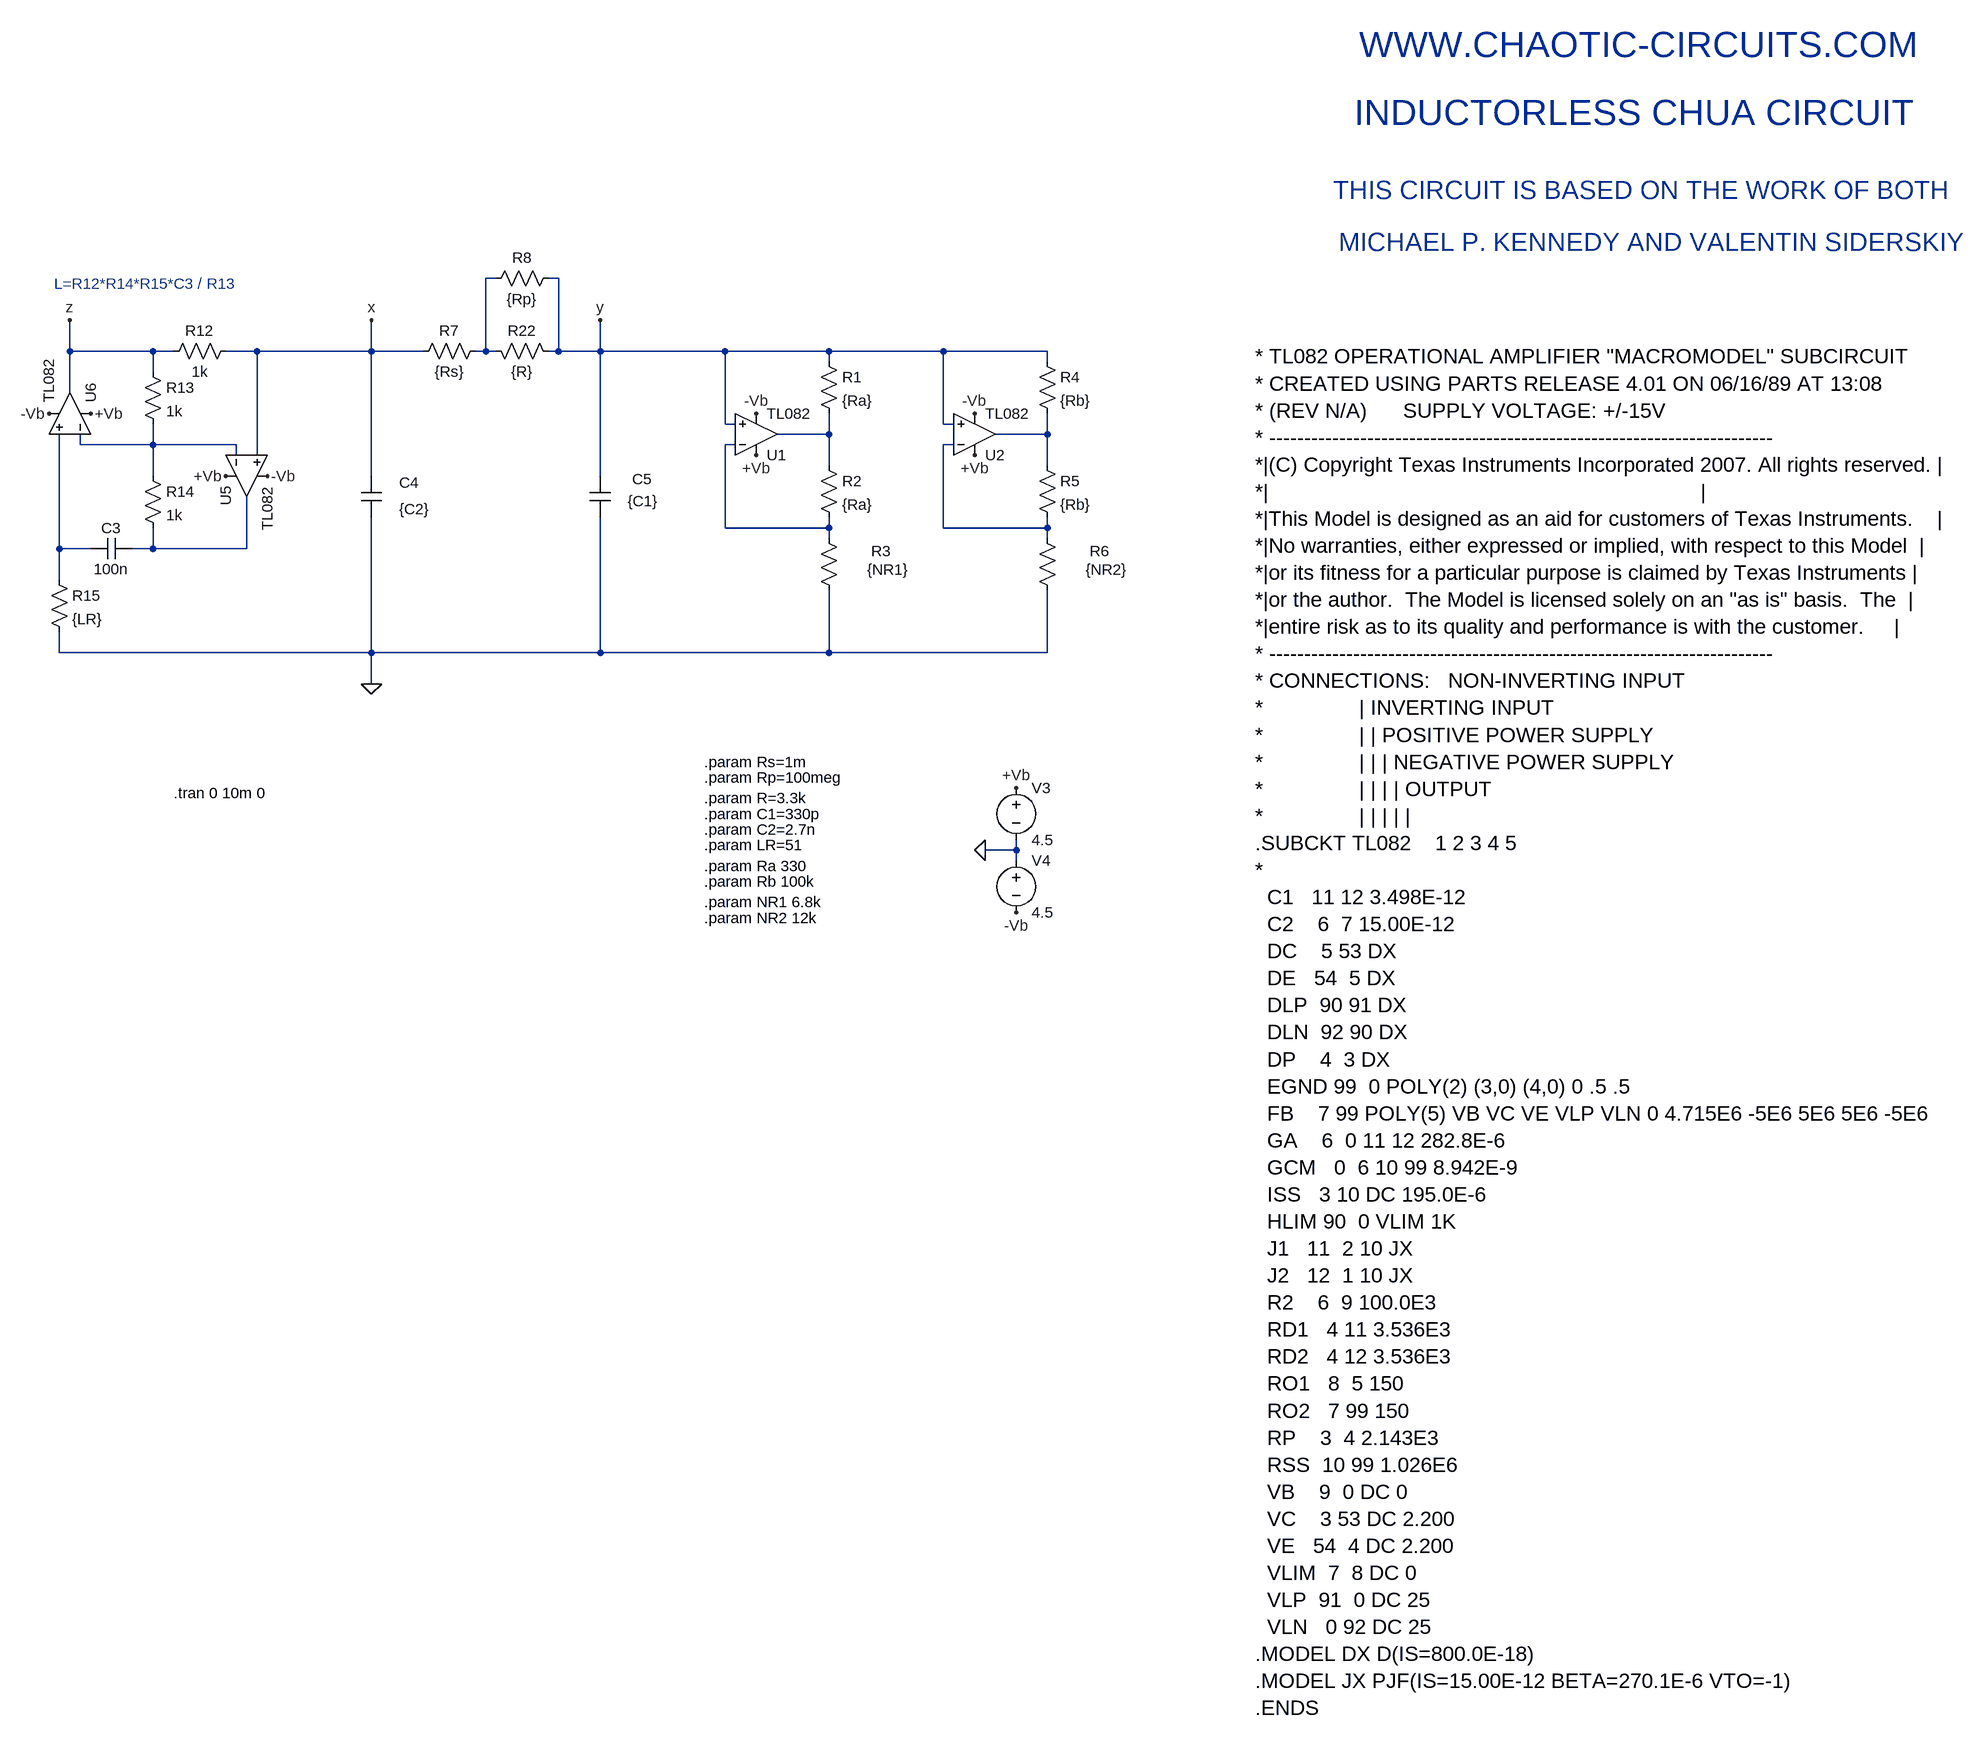
[diagram p0: schematic chua.asc]
chua.asc, the LTspice schematic file:
Version 4
SHEET 1 1280 2032
WIRE -1712 -912 -1728 -912
WIRE -1616 -912 -1632 -912
WIRE -2368 -800 -2368 -848
WIRE -2240 -800 -2368 -800
WIRE -2208 -800 -2240 -800
WIRE -2080 -800 -2128 -800
WIRE -1904 -800 -1904 -848
WIRE -1904 -800 -2080 -800
WIRE -1824 -800 -1904 -800
WIRE -1728 -800 -1728 -912
WIRE -1728 -800 -1744 -800
WIRE -1712 -800 -1728 -800
WIRE -1616 -800 -1616 -912
WIRE -1616 -800 -1632 -800
WIRE -1552 -800 -1552 -848
WIRE -1552 -800 -1616 -800
WIRE -1360 -800 -1552 -800
WIRE -1200 -800 -1360 -800
WIRE -1024 -800 -1200 -800
WIRE -864 -800 -1024 -800
WIRE -1200 -784 -1200 -800
WIRE -864 -784 -864 -800
WIRE -2240 -768 -2240 -800
WIRE -2368 -736 -2368 -800
WIRE -1360 -688 -1360 -800
WIRE -1344 -688 -1360 -688
WIRE -1024 -688 -1024 -800
WIRE -1008 -688 -1024 -688
WIRE -1200 -672 -1200 -704
WIRE -1200 -672 -1280 -672
WIRE -864 -672 -864 -704
WIRE -864 -672 -944 -672
WIRE -2352 -656 -2352 -672
WIRE -2240 -656 -2240 -688
WIRE -2240 -656 -2352 -656
WIRE -2112 -656 -2240 -656
WIRE -1344 -656 -1360 -656
WIRE -1008 -656 -1024 -656
WIRE -2112 -640 -2112 -656
WIRE -2080 -640 -2080 -800
WIRE -1200 -624 -1200 -672
WIRE -864 -624 -864 -672
WIRE -2240 -608 -2240 -656
WIRE -1904 -608 -1904 -800
WIRE -1552 -608 -1552 -800
WIRE -1360 -528 -1360 -656
WIRE -1200 -528 -1200 -544
WIRE -1200 -528 -1360 -528
WIRE -1024 -528 -1024 -656
WIRE -864 -528 -864 -544
WIRE -864 -528 -1024 -528
WIRE -1200 -512 -1200 -528
WIRE -864 -512 -864 -528
WIRE -2384 -496 -2384 -672
WIRE -2336 -496 -2384 -496
WIRE -2240 -496 -2240 -528
WIRE -2240 -496 -2272 -496
WIRE -2096 -496 -2096 -576
WIRE -2096 -496 -2240 -496
WIRE -2384 -448 -2384 -496
WIRE -2384 -336 -2384 -368
WIRE -1904 -336 -1904 -544
WIRE -1904 -336 -2384 -336
WIRE -1552 -336 -1552 -544
WIRE -1552 -336 -1904 -336
WIRE -1200 -336 -1200 -432
WIRE -1200 -336 -1552 -336
WIRE -864 -336 -864 -432
WIRE -864 -336 -1200 -336
WIRE -1904 -288 -1904 -336
WIRE -912 -32 -912 -48
WIRE -912 -32 -960 -32
WIRE -912 -16 -912 -32
FLAG -912 64 -Vb
FLAG -912 -128 +Vb
FLAG -2400 -704 -Vb
FLAG -2064 -608 -Vb
FLAG -2336 -704 +Vb
FLAG -2128 -608 +Vb
FLAG -1904 -848 x
FLAG -1552 -848 y
FLAG -1904 -288 0
FLAG -960 -32 0
FLAG -1312 -704 -Vb
FLAG -1312 -640 +Vb
FLAG -976 -704 -Vb
FLAG -976 -640 +Vb
FLAG -2368 -848 z
SYMBOL Opamps\\opamp2 -2160 -608 M90
SYMATTR InstName U5
SYMATTR Value TL082
SYMBOL voltage -912 -144 R0
WINDOW 123 0 0 Left 2
WINDOW 39 24 124 Left 2
SYMATTR InstName V3
SYMATTR Value 4.5
SYMBOL voltage -912 -32 R0
WINDOW 123 0 0 Left 2
WINDOW 39 24 124 Left 2
SYMATTR InstName V4
SYMATTR Value 4.5
SYMBOL res -2112 -816 R90
WINDOW 0 0 56 VBottom 2
WINDOW 3 32 56 VTop 2
SYMATTR InstName R12
SYMATTR Value 1k
SYMBOL res -2256 -784 R0
SYMATTR InstName R13
SYMATTR Value 1k
SYMBOL Opamps\\opamp2 -2304 -704 M270
SYMATTR InstName U6
SYMATTR Value TL082
SYMBOL res -2256 -624 R0
SYMATTR InstName R14
SYMATTR Value 1k
SYMBOL cap -2272 -512 R90
WINDOW 3 32 32 VTop 2
WINDOW 0 0 32 VBottom 2
SYMATTR Value 100n
SYMATTR InstName C3
SYMBOL res -2400 -464 R0
SYMATTR InstName R15
SYMATTR Value {LR}
SYMBOL cap -1920 -608 R0
WINDOW 0 59 10 Left 2
WINDOW 3 59 51 Left 2
SYMATTR InstName C4
SYMATTR Value {C2}
SYMATTR SpiceLine V=100
SYMBOL cap -1568 -608 R0
WINDOW 0 65 5 Left 2
WINDOW 3 58 39 Left 2
SYMATTR InstName C5
SYMATTR Value {C1}
SYMATTR SpiceLine V=100
SYMBOL res -1616 -784 M270
WINDOW 0 32 56 VTop 2
WINDOW 3 0 56 VBottom 2
SYMATTR InstName R22
SYMATTR Value {R}
SYMATTR SpiceLine tol=5 pwr=1
SYMBOL Opamps\\opamp2 -1312 -608 M180
SYMATTR InstName U1
SYMATTR Value TL082
SYMBOL res -1216 -800 R0
SYMATTR InstName R1
SYMATTR Value {Ra}
SYMATTR SpiceLine tol=5 pwr=1
SYMBOL res -1216 -640 R0
SYMATTR InstName R2
SYMATTR Value {Ra}
SYMATTR SpiceLine tol=5 pwr=1
SYMBOL res -1216 -528 R0
WINDOW 0 81 36 Left 2
WINDOW 3 75 64 Left 2
SYMATTR InstName R3
SYMATTR Value {NR1}
SYMATTR SpiceLine tol=5 pwr=1
SYMBOL Opamps\\opamp2 -976 -608 M180
SYMATTR InstName U2
SYMATTR Value TL082
SYMBOL res -880 -800 R0
SYMATTR InstName R4
SYMATTR Value {Rb}
SYMATTR SpiceLine tol=5 pwr=1
SYMBOL res -880 -640 R0
SYMATTR InstName R5
SYMATTR Value {Rb}
SYMATTR SpiceLine tol=5 pwr=1
SYMBOL res -880 -528 R0
WINDOW 0 81 36 Left 2
WINDOW 3 75 64 Left 2
SYMATTR InstName R6
SYMATTR Value {NR2}
SYMATTR SpiceLine tol=5 pwr=1
SYMBOL res -1728 -816 R90
WINDOW 0 0 56 VBottom 2
WINDOW 3 32 56 VTop 2
SYMATTR InstName R7
SYMATTR Value {Rs}
SYMBOL res -1616 -928 R90
WINDOW 0 0 56 VBottom 2
WINDOW 3 32 56 VTop 2
SYMATTR InstName R8
SYMATTR Value {Rp}
TEXT -384 -1272 Left 5 ;WWW.CHAOTIC-CIRCUITS.COM
TEXT -544 -792 Left 3 !* TL082 OPERATIONAL AMPLIFIER "MACROMODEL" SUBCIRCUIT\n* CREATED USING PARTS RELEASE 4.01 ON 06/16/89 AT 13:08\n* (REV N/A)      SUPPLY VOLTAGE: +/-15V\n* ------------------------------------------------------------------------\n*|(C) Copyright Texas Instruments Incorporated 2007. All rights reserved. |\n*|                                                                        |\n*|This Model is designed as an aid for customers of Texas Instruments.    |\n*|No warranties, either expressed or implied, with respect to this Model  |\n*|or its fitness for a particular purpose is claimed by Texas Instruments |\n*|or the author.  The Model is licensed solely on an "as is" basis.  The  |\n*|entire risk as to its quality and performance is with the customer.     |\n* ------------------------------------------------------------------------\n* CONNECTIONS:   NON-INVERTING INPUT\n*                | INVERTING INPUT\n*                | | POSITIVE POWER SUPPLY\n*                | | | NEGATIVE POWER SUPPLY\n*                | | | | OUTPUT\n*                | | | | |\n.SUBCKT TL082    1 2 3 4 5\n*\n  C1   11 12 3.498E-12\n  C2    6  7 15.00E-12\n  DC    5 53 DX\n  DE   54  5 DX\n  DLP  90 91 DX\n  DLN  92 90 DX\n  DP    4  3 DX\n  EGND 99  0 POLY(2) (3,0) (4,0) 0 .5 .5\n  FB    7 99 POLY(5) VB VC VE VLP VLN 0 4.715E6 -5E6 5E6 5E6 -5E6\n  GA    6  0 11 12 282.8E-6\n  GCM   0  6 10 99 8.942E-9\n  ISS   3 10 DC 195.0E-6\n  HLIM 90  0 VLIM 1K\n  J1   11  2 10 JX\n  J2   12  1 10 JX\n  R2    6  9 100.0E3\n  RD1   4 11 3.536E3\n  RD2   4 12 3.536E3\n  RO1   8  5 150\n  RO2   7 99 150\n  RP    3  4 2.143E3\n  RSS  10 99 1.026E6\n  VB    9  0 DC 0\n  VC    3 53 DC 2.200\n  VE   54  4 DC 2.200\n  VLIM  7  8 DC 0\n  VLP  91  0 DC 25\n  VLN   0 92 DC 25\n.MODEL DX D(IS=800.0E-18)\n.MODEL JX PJF(IS=15.00E-12 BETA=270.1E-6 VTO=-1)\n.ENDS
TEXT -392 -1168 Left 5 ;INDUCTORLESS CHUA CIRCUIT
TEXT -424 -1048 Left 4 ;THIS CIRCUIT IS BASED ON THE WORK OF BOTH
TEXT -416 -968 Left 4 ;MICHAEL P. KENNEDY AND VALENTIN SIDERSKIY
TEXT -2208 -120 Left 2 !.tran 0 10m 0
TEXT -2392 -904 Left 2 ;L=R12*R14*R15*C3 / R13
TEXT -1392 -88 Left 2 !.param C1=330p
TEXT -1392 -64 Left 2 !.param C2=2.7n
TEXT -1392 -112 Left 2 !.param R=3.3k
TEXT -1392 -40 Left 2 !.param LR=51
TEXT -1392 -168 Left 2 !.param Rs=1m
TEXT -1392 -144 Left 2 !.param Rp=100meg
TEXT -1392 -8 Left 2 !.param Ra 330
TEXT -1392 16 Left 2 !.param Rb 100k
TEXT -1392 48 Left 2 !.param NR1 6.8k
TEXT -1392 72 Left 2 !.param NR2 12k

The netlist it stands for:
* chua.asc
XU5 x N004 +Vb -Vb N008 TL082  ; pins In+ In- V+ V- OUT
V3 +Vb 0 4.5
V4 0 -Vb 4.5
R12 x z 1k
R13 z N004 1k
XU6 N007 N004 +Vb -Vb z TL082  ; pins In+ In- V+ V- OUT
R14 N004 N008 1k
C3 N008 N007 100n
R15 N007 0 {LR}
C4 x 0 {C2} V=100
C5 y 0 {C1} V=100
R22 y N001 {R} tol=5 pwr=1
XU1 y N005 +Vb -Vb N002 TL082  ; pins In+ In- V+ V- OUT
R1 y N002 {Ra} tol=5 pwr=1
R2 N002 N005 {Ra} tol=5 pwr=1
R3 N005 0 {NR1} tol=5 pwr=1
XU2 y N006 +Vb -Vb N003 TL082  ; pins In+ In- V+ V- OUT
R4 y N003 {Rb} tol=5 pwr=1
R5 N003 N006 {Rb} tol=5 pwr=1
R6 N006 0 {NR2} tol=5 pwr=1
R7 N001 x {Rs}
R8 y N001 {Rp}
* WWW.CHAOTIC-CIRCUITS.COM
* TL082 OPERATIONAL AMPLIFIER "MACROMODEL" SUBCIRCUIT
* CREATED USING PARTS RELEASE 4.01 ON 06/16/89 AT 13:08
* (REV N/A)      SUPPLY VOLTAGE: +/-15V
* ------------------------------------------------------------------------
*|(C) Copyright Texas Instruments Incorporated 2007. All rights reserved. |
*|                                                                        |
*|This Model is designed as an aid for customers of Texas Instruments.    |
*|No warranties, either expressed or implied, with respect to this Model  |
*|or its fitness for a particular purpose is claimed by Texas Instruments |
*|or the author.  The Model is licensed solely on an "as is" basis.  The  |
*|entire risk as to its quality and performance is with the customer.     |
* ------------------------------------------------------------------------
* CONNECTIONS:   NON-INVERTING INPUT
*                | INVERTING INPUT
*                | | POSITIVE POWER SUPPLY
*                | | | NEGATIVE POWER SUPPLY
*                | | | | OUTPUT
*                | | | | |
.SUBCKT TL082    1 2 3 4 5
*
  C1   11 12 3.498E-12
  C2    6  7 15.00E-12
  DC    5 53 DX
  DE   54  5 DX
  DLP  90 91 DX
  DLN  92 90 DX
  DP    4  3 DX
  EGND 99  0 POLY(2) (3,0) (4,0) 0 .5 .5
  FB    7 99 POLY(5) VB VC VE VLP VLN 0 4.715E6 -5E6 5E6 5E6 -5E6
  GA    6  0 11 12 282.8E-6
  GCM   0  6 10 99 8.942E-9
  ISS   3 10 DC 195.0E-6
  HLIM 90  0 VLIM 1K
  J1   11  2 10 JX
  J2   12  1 10 JX
  R2    6  9 100.0E3
  RD1   4 11 3.536E3
  RD2   4 12 3.536E3
  RO1   8  5 150
  RO2   7 99 150
  RP    3  4 2.143E3
  RSS  10 99 1.026E6
  VB    9  0 DC 0
  VC    3 53 DC 2.200
  VE   54  4 DC 2.200
  VLIM  7  8 DC 0
  VLP  91  0 DC 25
  VLN   0 92 DC 25
.MODEL DX D(IS=800.0E-18)
.MODEL JX PJF(IS=15.00E-12 BETA=270.1E-6 VTO=-1)
.ENDS
* INDUCTORLESS CHUA CIRCUIT
* THIS CIRCUIT IS BASED ON THE WORK OF BOTH
* MICHAEL P. KENNEDY AND VALENTIN SIDERSKIY
.tran 0 10m 0
* L=R12*R14*R15*C3 / R13
.param C1=330p
.param C2=2.7n
.param R=3.3k
.param LR=51
.param Rs=1m
.param Rp=100meg
.param Ra 330
.param Rb 100k
.param NR1 6.8k
.param NR2 12k
.backanno
.end